# EAGLE design relay_board (EAGLE 9.3.0)
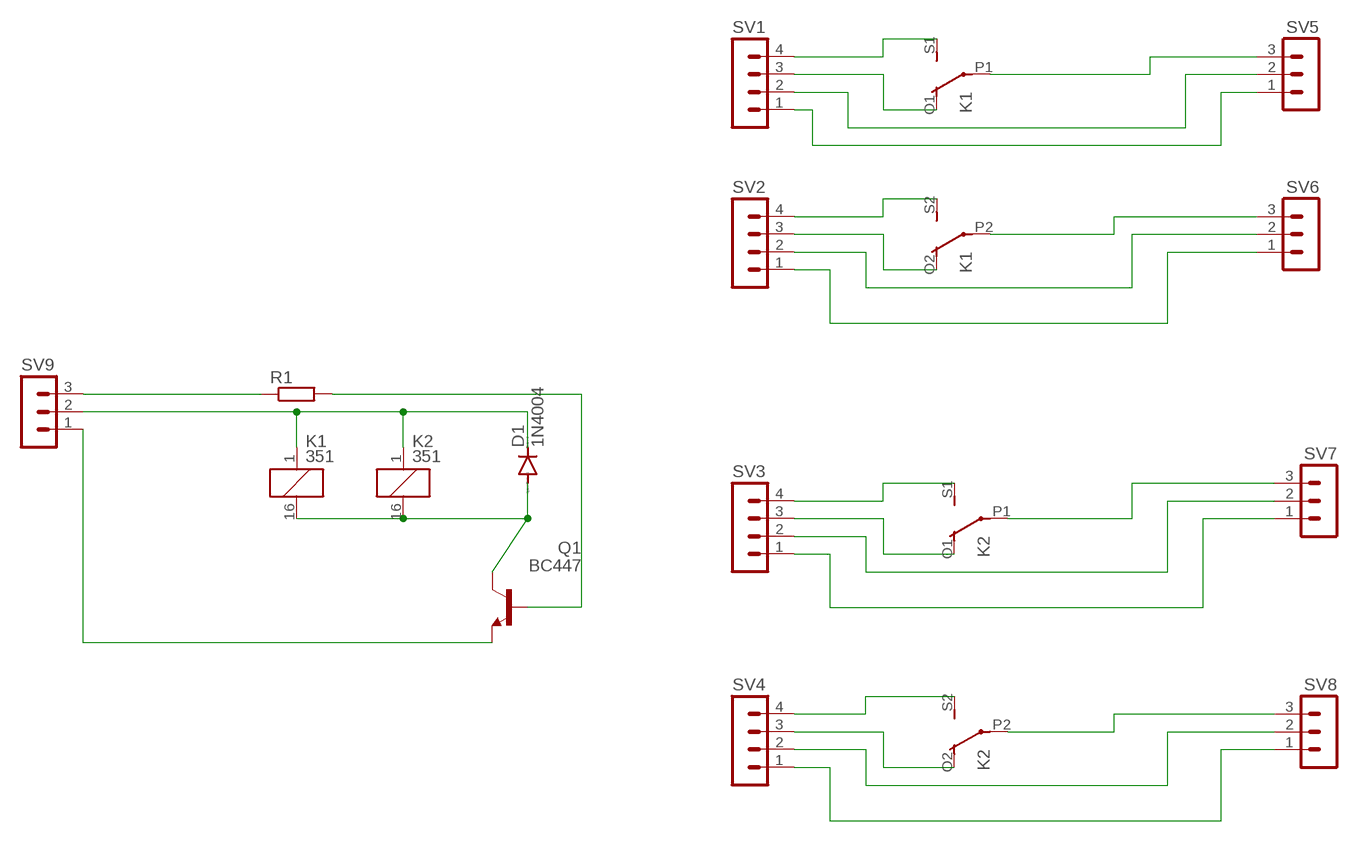
[diagram p0: schematic, sheet 1]

## Parts
D1  1N4004  [DO41-10]
K1  351  [351]
K2  351  [351]
Q1  BC447  [TO92-EBC]
R1  R-EU_0207/15  [0207/15]
SV1  MA04-1  [MA04-1]
SV2  MA04-1  [MA04-1]
SV3  MA04-1  [MA04-1]
SV4  MA04-1  [MA04-1]
SV5  MA03-1  [MA03-1]
SV6  MA03-1  [MA03-1]
SV7  MA03-1  [MA03-1]
SV8  MA03-1  [MA03-1]
SV9  MA03-1  [MA03-1]

## Nets
N$1: K1.O1(2:O) SV1.3
N$2: K1.S1(2:S) SV1.4
N$3: K1.S2(3:S) SV2.4
N$4: K1.O2(3:O) SV2.3
N$5: K2.S1(2:S) SV3.4
N$6: K2.O1(2:O) SV3.3
N$7: K2.S2(3:S) SV4.4
N$8: K2.O2(3:O) SV4.3
N$9: K1.P1(2:P) SV5.3
N$10: SV1.1 SV5.1
N$11: SV1.2 SV5.2
N$12: K1.P2(3:P) SV6.3
N$13: SV2.2 SV6.2
N$14: SV2.1 SV6.1
N$15: K2.P1(2:P) SV7.3
N$16: K2.P2(3:P) SV8.3
N$17: SV3.2 SV7.2
N$18: SV3.1 SV7.1
N$19: SV4.2 SV8.2
N$20: SV4.1 SV8.1
N$21: D1.C K1.1 K2.1 SV9.2
N$22: D1.A K1.16 K2.16 Q1.C
N$23: Q1.E SV9.1
N$24: R1.1 SV9.3
N$25: Q1.B R1.2

## Library data of the parts
D1 = diode:1N4004: DIODE general purpose rectifier, 1 A
K1 K2 = relay:351: RELAY 2 x switch, Omron; OC_FARNELL: unknown; OC_NEWARK: unknown
Q1 = transistor-npn:BC447*: NPN Transistor
R1 = rcl:R-EU_: RESISTOR, European symbol; SPICEPREFIX: R
SV1-SV4 = con-lstb:MA04-1: PIN HEADER; OC_FARNELL: unknown; OC_NEWARK: unknown
SV5-SV9 = con-lstb:MA03-1: PIN HEADER; OC_FARNELL: unknown; OC_NEWARK: unknown

## Board
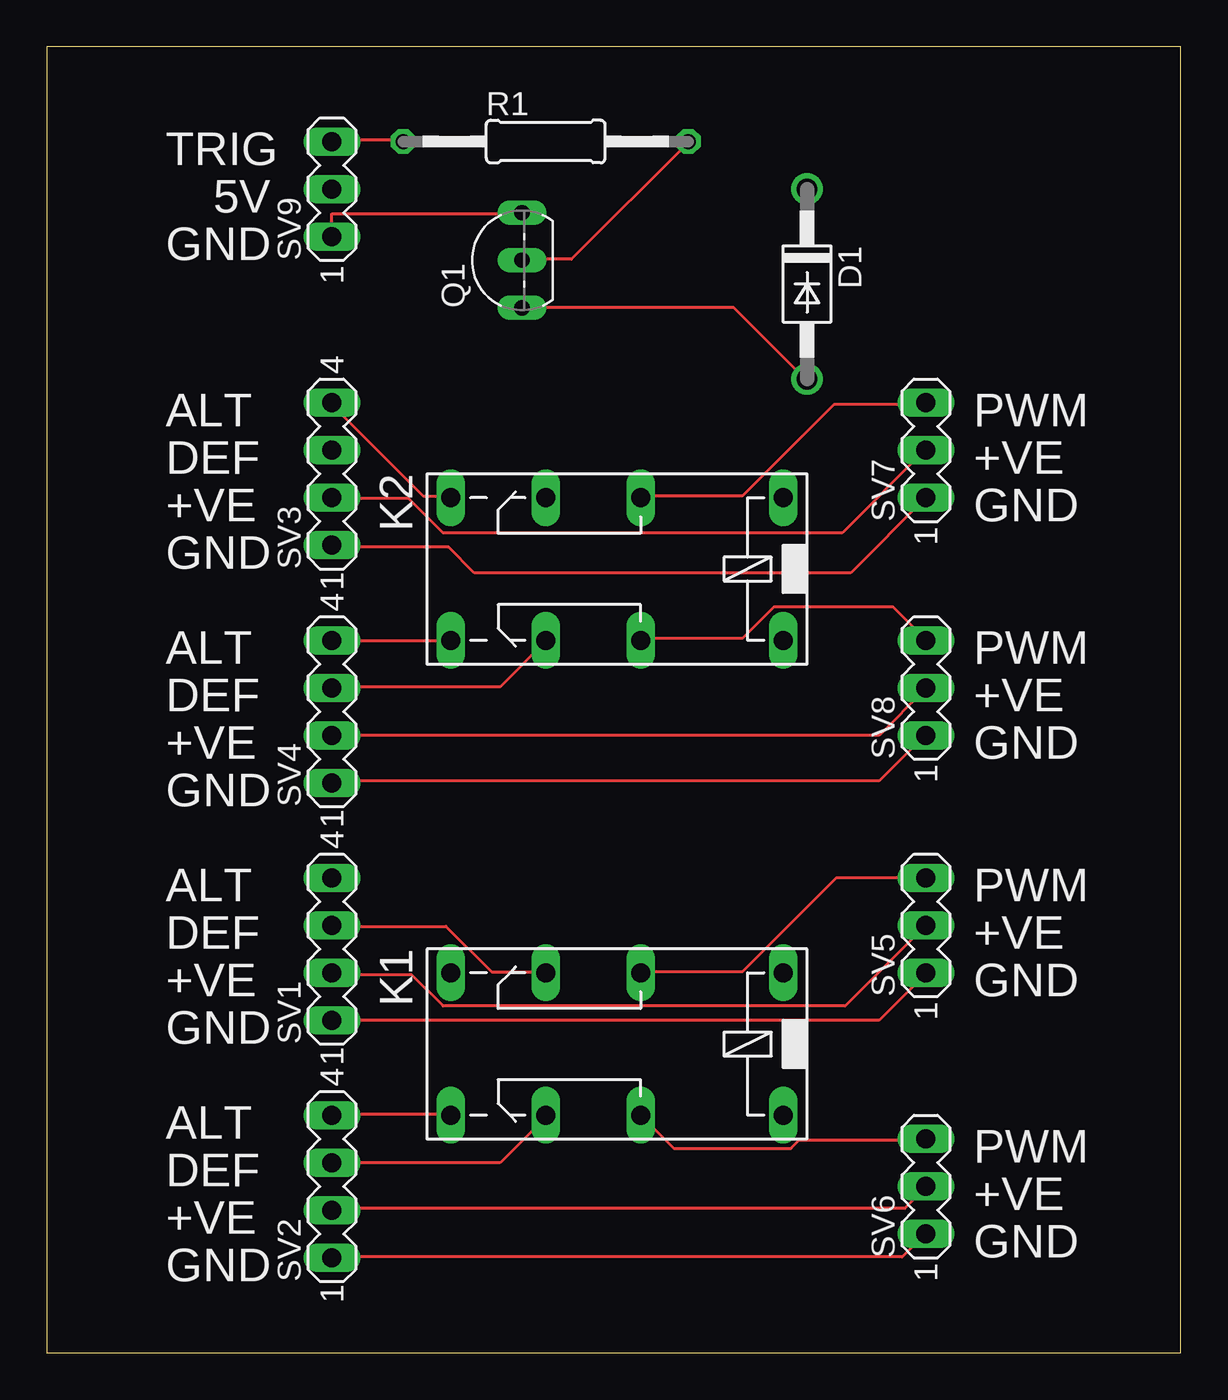
[diagram p1: board, top side]
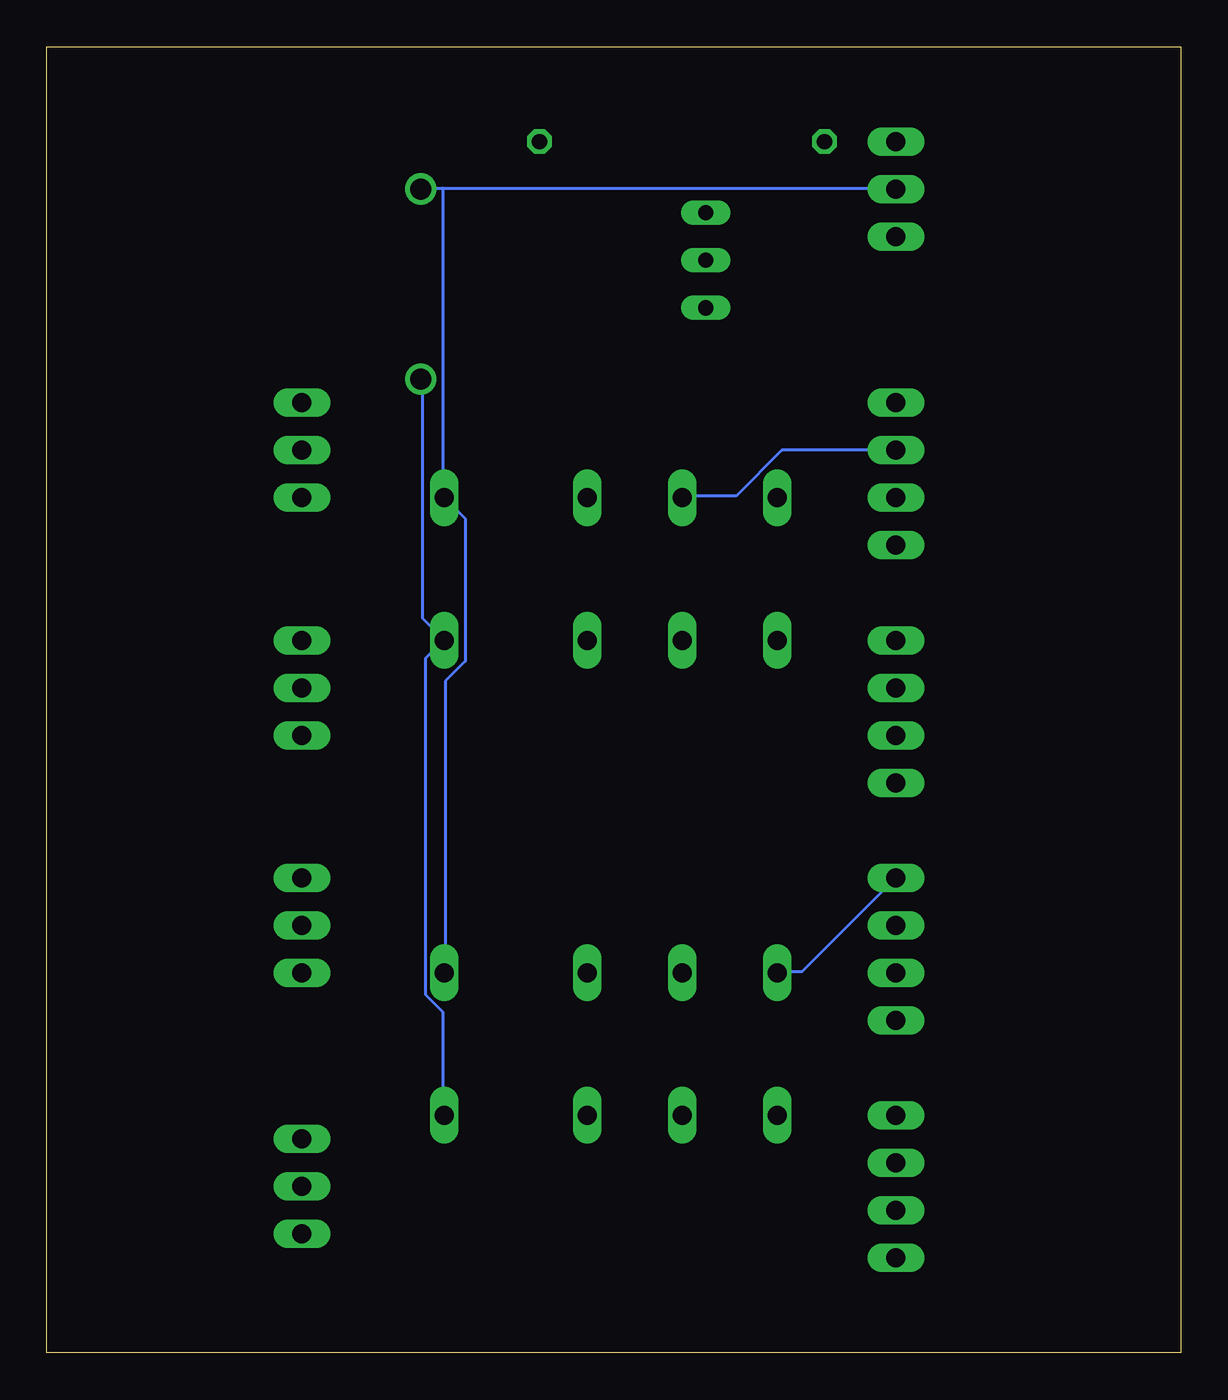
[diagram p2: board, bottom side, seen from below]

Size 60.63 x 69.84 mm. Coordinates in mm from the lower left corner, seen from the top.
Outline: 0,0 60.63,0 60.63,69.84 0,69.84 0,0
Copper layers (1*16): Top 0.035mm / dielectric 1.5mm / Bottom 0.035mm
Design rules "default": minimum track width 6mil, minimum drill 0.35mm, track to track 6mil, track to pad 6mil, pad to pad 6mil, via to via 6mil, smd to smd 6mil, copper to edge 40mil, drill to drill 6mil, minimum pad ring 10mil, minimum via ring 8mil, stop-mask expansion 4mil, vias tented up to drill 0mil, thermal gap 10mil

### Footprints (pad centres in the part's own frame; a part is rotated, then mirrored left to right if it is on the bottom)
DO41-10 = drill 1.118: A 5.08,0; C -5.08,0
351 = drill 1.016 long: 1 -3.81,-3.81; 16 -3.81,3.81; O1 8.89,-3.81; O2 8.89,3.81; P1 3.81,-3.81; P2 3.81,3.81; S1 13.97,-3.81; S2 13.97,3.81
TO92-EBC = drill 0.813 long: B 0,-1.27; C -2.54,-1.27; E 2.54,-1.27
0207/15 = drill 0.813 octagon: 1 -7.62,0; 2 7.62,0
MA04-1 = drill 1.016 long: 1 -3.81,0; 2 -1.27,0; 3 1.27,0; 4 3.81,0
MA03-1 = drill 1.016 long: 1 -2.54,0; 2 0,0; 3 2.54,0

### Placement (x,y rotation side)
D1  40.64,57.15 270 top
K1  35.56,16.51 180 top
K2  35.56,41.91 180 top
Q1  24.13,58.42 90 top
R1  26.67,64.77 0 top
SV1  15.24,21.59 90 top
SV2  15.24,8.89 90 top
SV3  15.24,46.99 90 top
SV4  15.24,34.29 90 top
SV5  46.99,22.86 90 top
SV6  46.99,8.89 90 top
SV7  46.99,48.26 90 top
SV8  46.99,35.56 90 top
SV9  15.24,62.23 90 top

### Tracks (layer width: path | path; a pad name or v marks a point on that pad's centre or on a via)
N$1
  Top 0.152: K1.O1 26.67,20.37 23.77,20.37 21.34,22.81 15.24,22.81 SV1.3
N$2
  Bottom 0.152: SV1.4 20.27,20.37 21.49,20.37 K1.S1
N$3
  Top 0.152: SV2.4 15.24,12.75 21.49,12.75 K1.S2
N$4
  Top 0.152: SV2.3 24.23,10.16 26.67,12.6 K1.O2
N$5
  Top 0.152: K2.S1 21.49,45.82 20.12,45.82 15.24,50.7 SV3.4
N$6
  Bottom 0.152: SV3.3 21.34,48.26 23.77,45.82 26.67,45.82 K2.O1
N$7
  Top 0.152: SV4.4 15.24,38.05 21.49,38.05 K2.S2
N$8
  Top 0.152: SV4.3 15.24,35.61 24.23,35.61 26.67,38.05 K2.O2
N$9
  Top 0.152: SV5.3 42.22,25.4 37.19,20.37 31.85,20.37 K1.P1
N$10
  Top 0.152: SV1.1 44.5,17.78 46.94,20.22 SV5.1
N$11
  Top 0.152: SV5.2 42.67,18.54 21.18,18.54 19.51,20.22 15.24,20.22 SV1.2
N$12
  Top 0.152: K1.P2 33.53,10.92 39.78,10.92 40.23,11.38 46.94,11.38 SV6.3
N$13
  Top 0.152: SV2.2 15.24,7.72 45.87,7.72 46.94,8.79 SV6.2
N$14
  Top 0.152: SV2.1 15.24,5.13 45.72,5.13 46.94,6.35 SV6.1
N$15
  Top 0.152: K2.P1 31.85,45.82 37.19,45.82 42.06,50.7 46.94,50.7 SV7.3
N$16
  Top 0.152: K2.P2 31.85,38.2 37.19,38.2 38.86,39.88 45.26,39.88 46.94,38.2 SV8.3
N$17
  Top 0.152: SV3.2 15.24,45.67 19.36,45.67 21.18,43.84 42.52,43.84 46.94,48.26 SV7.2
N$18
  Top 0.152: SV7.1 42.98,41.71 22.86,41.71 21.49,43.08 15.24,43.08 SV3.1
N$19
  Top 0.152: SV4.2 44.5,33.02 46.94,35.46 SV8.2
N$20
  Top 0.152: SV4.1 15.24,30.58 44.5,30.58 46.94,33.02 SV8.1
N$21
  Bottom 0.152: K1.1 39.32,20.37 39.32,35.92 38.25,36.98 38.25,44.6 K2.1 39.47,45.82 39.47,62.28 | 39.47,62.28 40.54,62.28 D1.C | 39.47,62.28 15.24,62.28 SV9.2
N$22
  Top 0.152: Q1.C 36.73,55.88 40.54,52.07 D1.A
  Bottom 0.152: K1.16 39.47,12.75 39.47,18.24 40.39,19.15 40.39,37.13 39.47,38.05 K2.16 40.54,39.27 40.54,52.07 D1.A
N$23
  Top 0.152: SV9.1 15.24,60.91 25.3,60.91 Q1.E
N$24
  Top 0.152: R1.1 19.05,64.87 15.24,64.87 SV9.3
N$25
  Top 0.152: Q1.B 25.45,58.47 28.04,58.47 34.29,64.72 R1.2

### Text on the board
tNames: TRIG | 5V | GND | ALT | PWM | DEF | +VE | +VE | GND | GND | ALT | PWM | DEF | +VE | +VE | GND | GND | ALT | PWM | DEF | +VE | +VE | GND | GND | ALT | PWM | DEF | +VE | +VE | GND | GND